# Altium schematic sheet Arduino Due.SchDoc
size 297 x 209 mm; CompanyName: Sainsbury Wellcome Centre; Organization: FabLab; Address1: Sainsbury Wellcome Centre; Address2: 25 Howland Street; Address3: London; Address4: W1T 4JG; DocumentNumber: 3; SheetNumber: 3; SheetTotal: 12; swcgroup: FabLab; Org: Sainsbury Wellcome Centre; Add1: 25 Howland Street; Add2: London; Add3: W1T 4JG; WebAddress: www.sainsburywellcome.org; SheetSize: A4; SheetName: Arduino Due
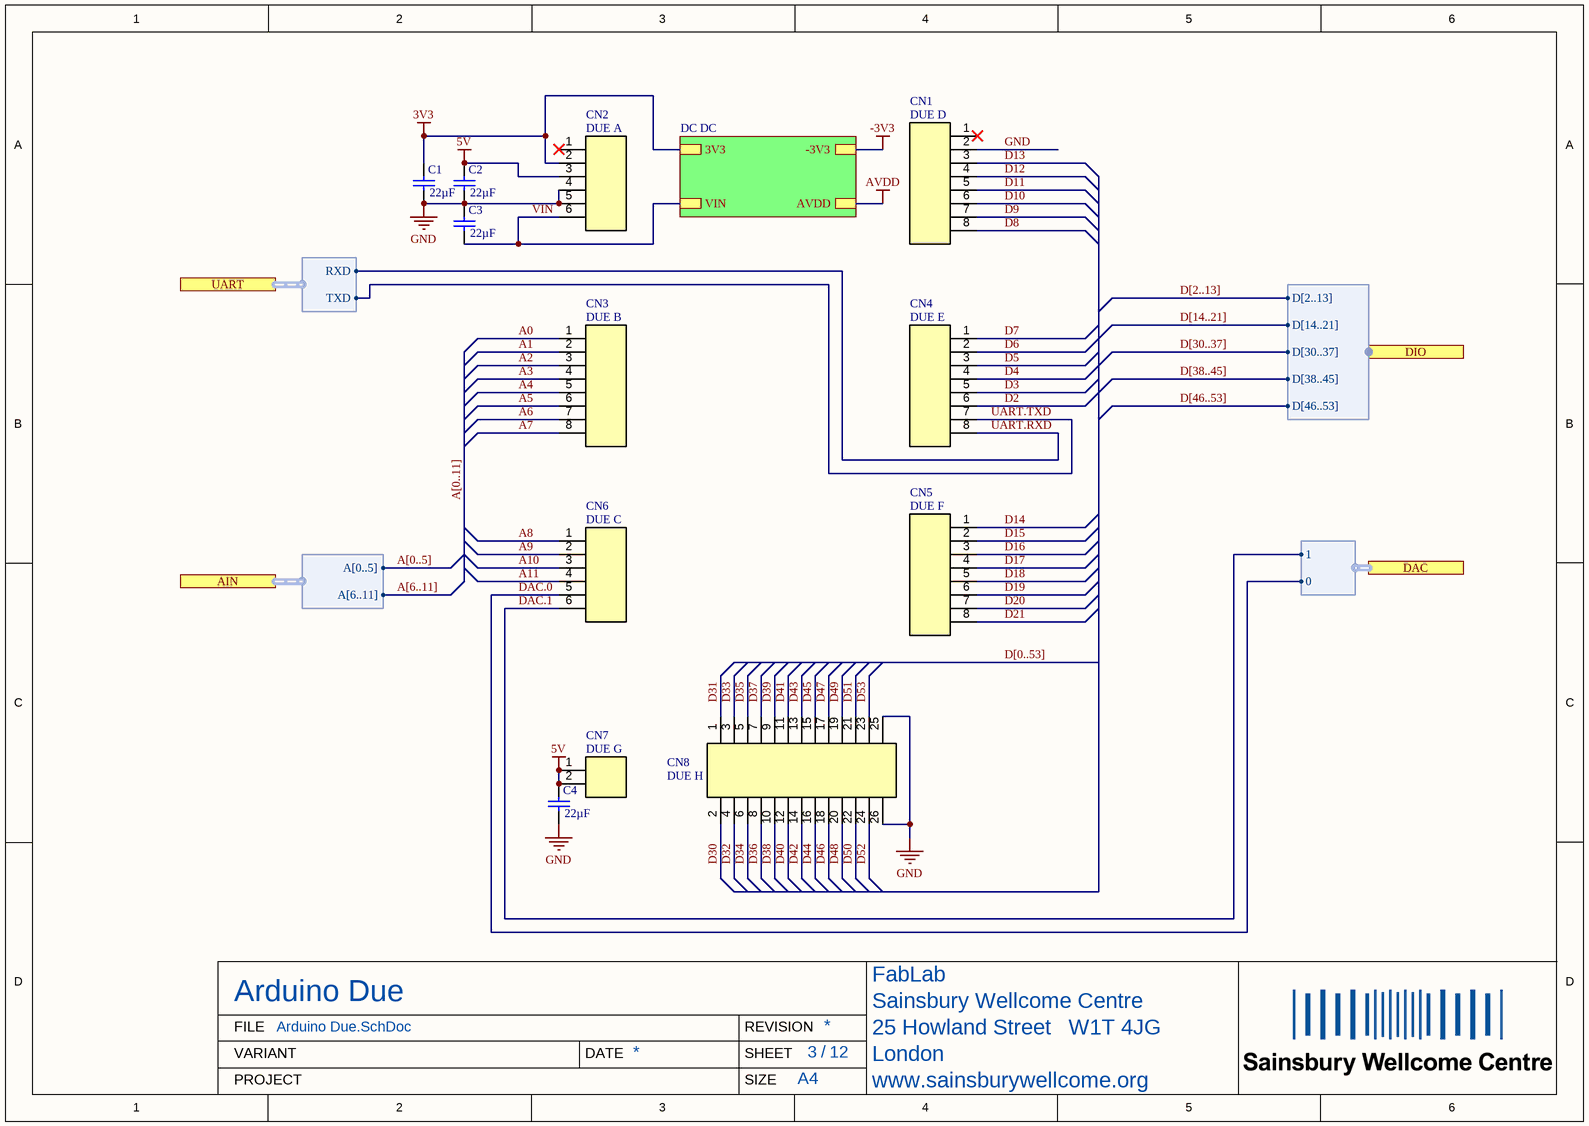
[diagram p0: Arduino Due.SchDoc]

## Parts
C1  value 22µF  [CAP_CHIP_0805]  (hidden comment: C0805-22uF-25V)
C2  value 22µF  [CAP_CHIP_0805]  (hidden comment: C0805-22uF-25V)
C3  value 22µF  [CAP_CHIP_0805]  (hidden comment: C0805-22uF-25V)
C4  value 22µF  [CAP_CHIP_0805]  (hidden comment: C0805-22uF-25V)
CN1  DUE D  [PIN_2.54_1X8P]
CN2  DUE A  [PIN_2.54_1X6P]
CN3  DUE B  [PIN_2.54_1X8P]
CN4  DUE E  [PIN_2.54_1X8P]
CN5  DUE F  [PIN_2.54_1X8P]
CN6  DUE C  [PIN_2.54_1X6P]
CN7  DUE G  [PIN_2.54_1X2P]
CN8  DUE H  [PIN_2.54_2X13P]

## Sub-sheets
DC DC = DC DC.SchDoc: VIN, 3V3, AVDD, -3V3

## Ports
AIN (harness AIN), DAC (harness DAC), DIO (harness DIO), UART (harness UART)

## Harnesses
AIN: A[6..11], A[0..5]
DIO: D[2..13], D[14..21], D[30..37], D[38..45], D[46..53]
DAC: 1, 0
UART: RXD, TXD

## Nets
3V3: C1.2 CN2.2 ; sheet DC DC/3V3
5V: C2.2 C4.2 CN2.3 CN7.1 CN7.2
-3V3: sheet DC DC/-3V3
AVDD: sheet DC DC/AVDD
GND: C1.1 C2.1 C3.2 C4.1 CN1.2 CN2.4 CN2.5 CN8.25 CN8.26
A0: CN3.1
A1: CN3.2
A2: CN3.3
A3: CN3.4
A4: CN3.5
A5: CN3.6
A6: CN3.7
A7: CN3.8
A8: CN6.1
A9: CN6.2
A10: CN6.3
A11: CN6.4
D2: CN4.6
D3: CN4.5
D4: CN4.4
D5: CN4.3
D6: CN4.2
D7: CN4.1
D8: CN1.8
D9: CN1.7
D10: CN1.6
D11: CN1.5
D12: CN1.4
D13: CN1.3
D14: CN5.1
D15: CN5.2
D16: CN5.3
D17: CN5.4
D18: CN5.5
D19: CN5.6
D20: CN5.7
D21: CN5.8
D30: CN8.2
D31: CN8.1
D32: CN8.4
D33: CN8.3
D34: CN8.6
D35: CN8.5
D36: CN8.8
D37: CN8.7
D38: CN8.10
D39: CN8.9
D40: CN8.12
D41: CN8.11
D42: CN8.14
D43: CN8.13
D44: CN8.16
D45: CN8.15
D46: CN8.18
D47: CN8.17
D48: CN8.20
D49: CN8.19
D50: CN8.22
D51: CN8.21
D52: CN8.24
D53: CN8.23
DAC.0: CN6.5 ; port DAC.0
DAC.1: CN6.6 ; port DAC.1
UART.RXD: CN4.8 ; port UART.RXD
UART.TXD: CN4.7 ; port UART.TXD
VIN: C3.1 CN2.6 ; sheet DC DC/VIN

Not connected (* = marked no-connect by the designer): CN1 1*; CN2 1*

## Buses and harness runs
bus A[0..5]
bus A[0..11]
bus A[6..11]
bus D[0..53]
bus D[2..13]
bus D[14..21]
bus D[30..37]
bus D[38..45]
bus D[46..53]

## Notes on the sheet
- FILE
- VARIANT
- DATE
- REVISION
- SHEET
- /
- PROJECT
- SIZE

## Library data of the parts
C1-C4 = CMP-611-0000-9: 0805 Multilayer Ceramic Capacitors MLCC; PartNumber: CL21A226MAQNNNE; Voltage Rating: 25V; Tolerance: 20%; Dielectric: X5R; Pick&PlaceFootprint: C0805; LCSC Part N.: C45783; Mount: SMD; RoHS: Yes; Capacitor Type: Ceramic; Case/Package: 0805
CN1 CN3-CN5 = CMP-380-0027-4: Straight Policy 2.5mm 8P 6mm -40℃~+105℃ 3mm 2.54mm Single Row Black Brass 1x10P Plugin,P=2.54mm Pin Headers ROHS; PartNumber: PZ254V-11-08P; Number of Positions: 8; Gender: Male; Number of Rows: 1; Orientation: Straight; Mount: Through Hole; Pitch: 2.54mm; LCSC Part N.: C492407; Number of Contacts: 8
CN2 CN6 = CMP-380-0028-3: Straight Policy 2.5mm 6P 6mm -40℃~+105℃ 3mm 2.54mm Single Row Black Brass 1x10P Plugin,P=2.54mm Pin Headers ROHS; PartNumber: PZ254V-11-06P; Number of Contacts: 6; Gender: Male; LCSC Part N.: C492405; Number of Positions: 6; Number of Rows: 1; Mount: Through Hole; Pitch: 2.54mm; Orientation: Straight
CN7 = CMP-380-0041-2: Straight Policy 2.5mm 6P 6mm -40℃~+105℃ 3mm 2.54mm Single Row Black Brass 1x10P Plugin,P=2.54mm Pin Headers ROHS; PartNumber: PZ254V-11-02P; Gender: Male; Number of Contacts: 2; Pitch: 2.54mm; Number of Rows: 1; Mount: Through Hole; LCSC Part N.: C492401; Number of Positions: 2; Orientation: Straight
CN8 = CMP-380-0040-1: Straight Policy 2.5mm 6mm -40℃~+105℃ 3mm 2.54mm Double Row Black Brass 2.54mm Plugin,P=2.54mm Pin Headers; PartNumber: PZ254-2-13-Z-8.5; Gender: Male; Number of Contacts: 24; Number of Positions: 12; Number of Rows: 2; Pitch: 2.54mm; Mount: Through Hole; LCSC Part N.: C2894974; Orientation: Straight